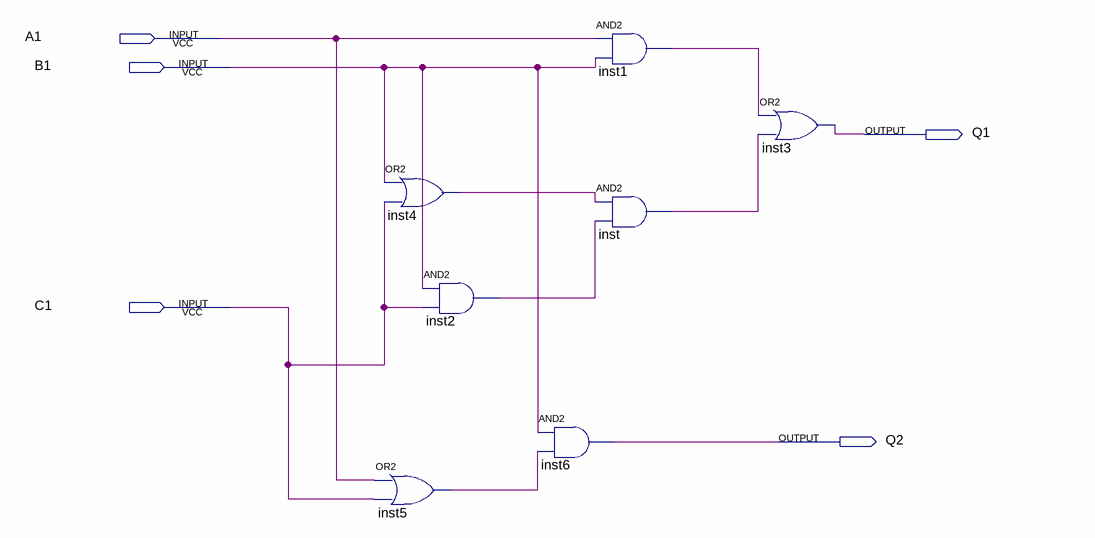
[diagram p0: schematic sheet]
// Quartus schematic Aula2.bdf as structural Verilog: 7 symbols, 5 pins
module Aula2 (
  input  A1,
  input  B1,
  input  C1,
  output Q1,
  output Q2
);

  wire inst1_out, inst2_out, inst4_out, inst5_out, inst_out;

  or inst5 (inst5_out, A1, C1);
  or inst4 (inst4_out, B1, C1);
  and inst2 (inst2_out, B1, C1);
  and inst1 (inst1_out, A1, B1);
  and inst (inst_out, inst4_out, inst2_out);
  and inst6 (Q2, B1, inst5_out);
  or inst3 (Q1, inst1_out, inst_out);
endmodule
